# Altium schematic sheet Reefing-USB.SchDoc: Reefing System
size A4; DocumentNumber: Subtitle; Revision: V1.0; SheetNumber: 12; SheetTotal: 13; Author: Luca Jost; Subtitle: USB
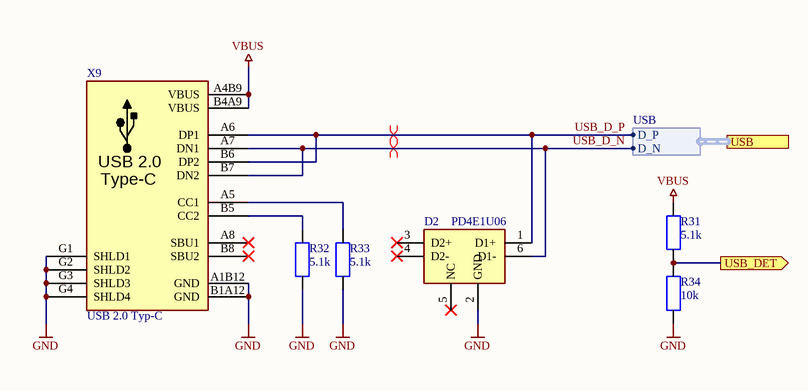
[diagram p0: Reefing-USB.SchDoc]

## Parts
D2  PD4E1U06  [SMD IC SOT-363 (SC-70-6)]
R31  5.1k  [SMD Widerstand 0402]
R32  5.1k  [SMD Widerstand 0402]
R33  5.1k  [SMD Widerstand 0402]
R34  10k  [SMD Widerstand 0402]
X9  USB 2.0 Typ-C  [THT USB-C Socket (A40-00119)]

## Ports
USB (harness USB), USB_DET (out)

## Harnesses
USB: D_N, D_P

## Nets
GND: D2.2(GND) R32.1 R33.1 R34.2 X9.A1B12(GND) X9.B1A12(GND) X9.G1(SHLD1) X9.G2(SHLD2) X9.G3(SHLD3) X9.G4(SHLD4)
VBUS: R31.1 X9.A4B9(VBUS) X9.B4A9(VBUS)
USB_D_N: D2.6(D1-) X9.A7(DN1) X9.B7(DN2) ; port USB.D_N
USB_D_P: D2.1(D1+) X9.A6(DP1) X9.B6(DP2) ; port USB.D_P
USB_DET: R31.2 R34.1 ; port USB_DET
NetR32_2: R32.2 X9.B5(CC2)
NetR33_2: R33.2 X9.A5(CC1)

Not connected (* = marked no-connect by the designer): D2 3(D2+)* 4(D2-)* 5(NC)*; X9 A8(SBU1)* B8(SBU2)*

## Layout directives
differential pair: USB_D_N, USB_D_P

## Notes on the sheet
- Title
- Author:
- Subtitle
- Date:
- Rev:
- File:
- Sheet
- of
- (in symbol USB Type-C USB 2.0) USB 2.0; Type-C

## Library data of the parts
D2 = PD4E1U06DCKR: Unidirectional 3A (8/20us) 15V (Typ) 6.5V 5.5V (Max) SOT-363 ESD Protection Devices ROHS; ComponentLink1Description: Datasheet; ComponentLink1URL: https://datasheet.lcsc.com/lcsc/1810172210_Texas-Instruments-TPD4E1U06DCKR_C194628.pdf; Digikey: 296-39347-1-ND; Farnell: 3116516; Mouser: 595-TPD4E1U06DCKR; Unit Price: 0.12; JLC: C194628
R31-R33 = E24 - 5.1k: SMD Chip Resistor E24; Unit Price: 0.01; JLC: C25905
R34 = E24 - 10k: SMD Chip Resistor E24; Unit Price: 0.01; JLC: C25744
X9 = USB Type-C USB 2.0: Typ-C; Digikey: 2073-USB4105-GF-ACT-ND; Farnell: 3583366; JLC: C167321; Unit Price: 0.36